# Altium schematic sheet con-left-top.SchDoc: Copper Suicide - Left Top
size Letter; CheckedBy: E. Chiu; CompanyName: Signal Laboratories, Inc.; DrawnBy: J. Brinton; Engineer: J. Brinton; Address1: 3479 Edison Way; Address2: Menlo Park CA 94025; Address3: +1 (877) 778-8435; Address4: siglabs.com; Revision: 1; SheetNumber: 30; SheetTotal: 44
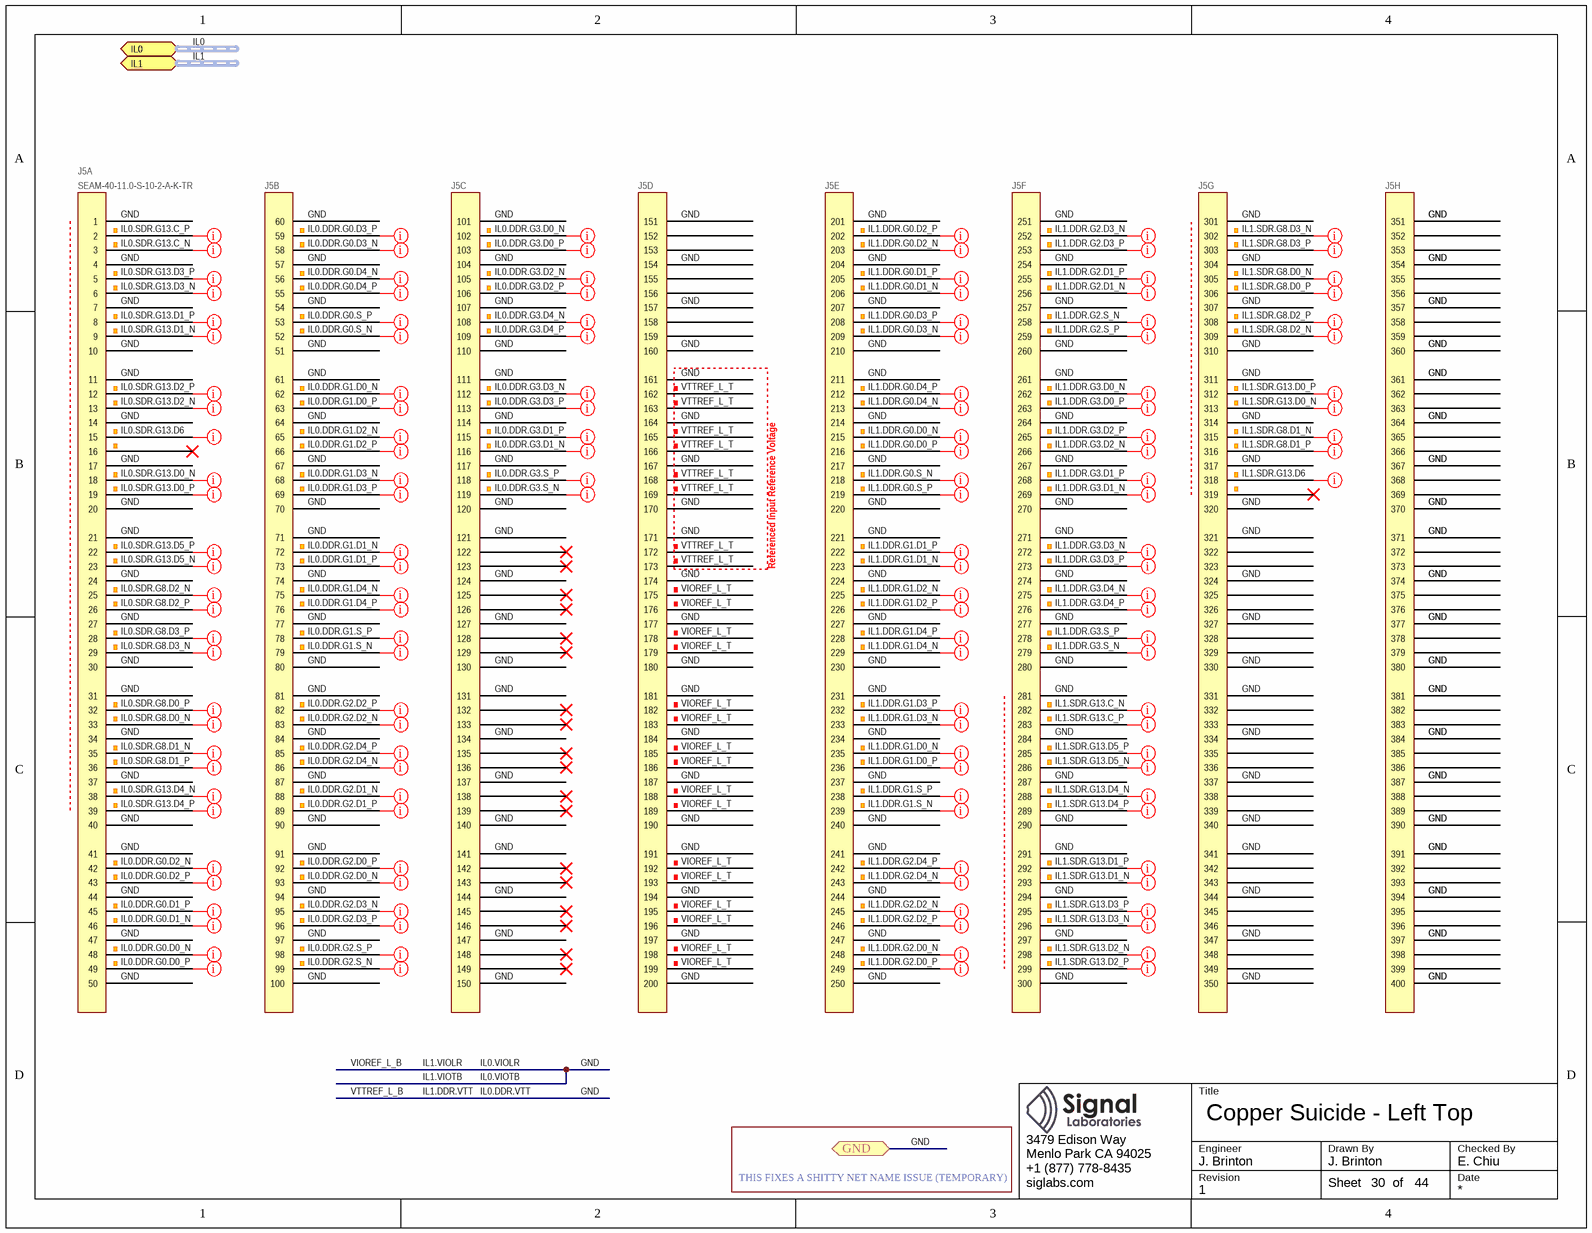
[diagram p0: con-left-top.SchDoc]

## Parts
J5  SEAM-40-11.0-S-10-2-A-K-TR  [SEAM-40-11.0-S-10-2-A-K-TR]  (parts A,B,C,D,E,F,G,H of 8)

## Ports
GND, IL0 (harness IL), IL1 (harness IL)

## Nets
GND: J5.1 J5.4 J5.7 J5.10 J5.11 J5.14 J5.17 J5.20 J5.21 J5.24 J5.27 J5.30 J5.31 J5.34 J5.37 J5.40 J5.41 J5.44 J5.47 J5.50 J5.51 J5.54 J5.57 J5.60 J5.61 J5.64 J5.67 J5.70 J5.71 J5.74 J5.77 J5.80 J5.81 J5.84 J5.87 J5.90 J5.91 J5.94 J5.97 J5.100 J5.101 J5.104 J5.107 J5.110 J5.111 J5.114 J5.117 J5.120 J5.121 J5.124 J5.127 J5.130 J5.131 J5.134 J5.137 J5.140 J5.141 J5.144 J5.147 J5.150 J5.151 J5.154 J5.157 J5.160 J5.161 J5.164 J5.167 J5.170 J5.171 J5.174 J5.177 J5.180 J5.181 J5.184 J5.187 J5.190 J5.191 J5.194 J5.197 J5.200 J5.201 J5.204 J5.207 J5.210 J5.211 J5.214 J5.217 J5.220 J5.221 J5.224 J5.227 J5.230 J5.231 J5.234 J5.237 J5.240 J5.241 J5.244 J5.247 J5.250 J5.251 J5.254 J5.257 J5.260 J5.261 J5.264 J5.267 J5.270 J5.271 J5.274 J5.277 J5.280 J5.281 J5.284 J5.287 J5.290 J5.291 J5.294 J5.297 J5.300 J5.301 J5.304 J5.307 J5.310 J5.311 J5.314 J5.317 J5.320 J5.321 J5.324 J5.327 J5.330 J5.331 J5.334 J5.337 J5.340 J5.341 J5.344 J5.347 J5.350 J5.351 J5.354 J5.357 J5.360 J5.361 J5.364 J5.367 J5.370 J5.371 J5.374 J5.377 J5.380 J5.381 J5.384 J5.387 J5.390 J5.391 J5.394 J5.397 J5.400 ; port GND  [also labelled IL0.DDR.VTT, IL0.VIOLR, IL0.VIOTB, IL1.DDR.VTT, IL1.VIOLR, IL1.VIOTB, VIOREF_L_B, VTTREF_L_B]
IL0.DDR.G0.D0_N: J5.48
IL0.DDR.G0.D0_P: J5.49
IL0.DDR.G0.D1_N: J5.46
IL0.DDR.G0.D1_P: J5.45
IL0.DDR.G0.D2_N: J5.42
IL0.DDR.G0.D2_P: J5.43
IL0.DDR.G0.D3_N: J5.58
IL0.DDR.G0.D3_P: J5.59
IL0.DDR.G0.D4_N: J5.56
IL0.DDR.G0.D4_P: J5.55
IL0.DDR.G0.S_N: J5.52
IL0.DDR.G0.S_P: J5.53
IL0.DDR.G1.D0_N: J5.62
IL0.DDR.G1.D0_P: J5.63
IL0.DDR.G1.D1_N: J5.72
IL0.DDR.G1.D1_P: J5.73
IL0.DDR.G1.D2_N: J5.65
IL0.DDR.G1.D2_P: J5.66
IL0.DDR.G1.D3_N: J5.68
IL0.DDR.G1.D3_P: J5.69
IL0.DDR.G1.D4_N: J5.75
IL0.DDR.G1.D4_P: J5.76
IL0.DDR.G1.S_N: J5.79
IL0.DDR.G1.S_P: J5.78
IL0.DDR.G2.D0_N: J5.93
IL0.DDR.G2.D0_P: J5.92
IL0.DDR.G2.D1_N: J5.88
IL0.DDR.G2.D1_P: J5.89
IL0.DDR.G2.D2_N: J5.83
IL0.DDR.G2.D2_P: J5.82
IL0.DDR.G2.D3_N: J5.95
IL0.DDR.G2.D3_P: J5.96
IL0.DDR.G2.D4_N: J5.86
IL0.DDR.G2.D4_P: J5.85
IL0.DDR.G2.S_N: J5.99
IL0.DDR.G2.S_P: J5.98
IL0.DDR.G3.D0_N: J5.102
IL0.DDR.G3.D0_P: J5.103
IL0.DDR.G3.D1_N: J5.116
IL0.DDR.G3.D1_P: J5.115
IL0.DDR.G3.D2_N: J5.105
IL0.DDR.G3.D2_P: J5.106
IL0.DDR.G3.D3_N: J5.112
IL0.DDR.G3.D3_P: J5.113
IL0.DDR.G3.D4_N: J5.108
IL0.DDR.G3.D4_P: J5.109
IL0.DDR.G3.S_N: J5.119
IL0.DDR.G3.S_P: J5.118
IL0.SDR.G8.D0_N: J5.33
IL0.SDR.G8.D0_P: J5.32
IL0.SDR.G8.D1_N: J5.35
IL0.SDR.G8.D1_P: J5.36
IL0.SDR.G8.D2_N: J5.25
IL0.SDR.G8.D2_P: J5.26
IL0.SDR.G8.D3_N: J5.29
IL0.SDR.G8.D3_P: J5.28
IL0.SDR.G13.C_N: J5.3
IL0.SDR.G13.C_P: J5.2
IL0.SDR.G13.D0_N: J5.18
IL0.SDR.G13.D0_P: J5.19
IL0.SDR.G13.D1_N: J5.9
IL0.SDR.G13.D1_P: J5.8
IL0.SDR.G13.D2_N: J5.13
IL0.SDR.G13.D2_P: J5.12
IL0.SDR.G13.D3_N: J5.6
IL0.SDR.G13.D3_P: J5.5
IL0.SDR.G13.D4_N: J5.38
IL0.SDR.G13.D4_P: J5.39
IL0.SDR.G13.D5_N: J5.23
IL0.SDR.G13.D5_P: J5.22
IL0.SDR.G13.D6: J5.15
IL1.DDR.G0.D0_N: J5.215
IL1.DDR.G0.D0_P: J5.216
IL1.DDR.G0.D1_N: J5.206
IL1.DDR.G0.D1_P: J5.205
IL1.DDR.G0.D2_N: J5.203
IL1.DDR.G0.D2_P: J5.202
IL1.DDR.G0.D3_N: J5.209
IL1.DDR.G0.D3_P: J5.208
IL1.DDR.G0.D4_N: J5.213
IL1.DDR.G0.D4_P: J5.212
IL1.DDR.G0.S_N: J5.218
IL1.DDR.G0.S_P: J5.219
IL1.DDR.G1.D0_N: J5.235
IL1.DDR.G1.D0_P: J5.236
IL1.DDR.G1.D1_N: J5.223
IL1.DDR.G1.D1_P: J5.222
IL1.DDR.G1.D2_N: J5.225
IL1.DDR.G1.D2_P: J5.226
IL1.DDR.G1.D3_N: J5.233
IL1.DDR.G1.D3_P: J5.232
IL1.DDR.G1.D4_N: J5.229
IL1.DDR.G1.D4_P: J5.228
IL1.DDR.G1.S_N: J5.239
IL1.DDR.G1.S_P: J5.238
IL1.DDR.G2.D0_N: J5.248
IL1.DDR.G2.D0_P: J5.249
IL1.DDR.G2.D1_N: J5.256
IL1.DDR.G2.D1_P: J5.255
IL1.DDR.G2.D2_N: J5.245
IL1.DDR.G2.D2_P: J5.246
IL1.DDR.G2.D3_N: J5.252
IL1.DDR.G2.D3_P: J5.253
IL1.DDR.G2.D4_N: J5.243
IL1.DDR.G2.D4_P: J5.242
IL1.DDR.G2.S_N: J5.258
IL1.DDR.G2.S_P: J5.259
IL1.DDR.G3.D0_N: J5.262
IL1.DDR.G3.D0_P: J5.263
IL1.DDR.G3.D1_N: J5.269
IL1.DDR.G3.D1_P: J5.268
IL1.DDR.G3.D2_N: J5.266
IL1.DDR.G3.D2_P: J5.265
IL1.DDR.G3.D3_N: J5.272
IL1.DDR.G3.D3_P: J5.273
IL1.DDR.G3.D4_N: J5.275
IL1.DDR.G3.D4_P: J5.276
IL1.DDR.G3.S_N: J5.279
IL1.DDR.G3.S_P: J5.278
IL1.SDR.G8.D0_N: J5.305
IL1.SDR.G8.D0_P: J5.306
IL1.SDR.G8.D1_N: J5.315
IL1.SDR.G8.D1_P: J5.316
IL1.SDR.G8.D2_N: J5.309
IL1.SDR.G8.D2_P: J5.308
IL1.SDR.G8.D3_N: J5.302
IL1.SDR.G8.D3_P: J5.303
IL1.SDR.G13.C_N: J5.282
IL1.SDR.G13.C_P: J5.283
IL1.SDR.G13.D0_N: J5.313
IL1.SDR.G13.D0_P: J5.312
IL1.SDR.G13.D1_N: J5.293
IL1.SDR.G13.D1_P: J5.292
IL1.SDR.G13.D2_N: J5.298
IL1.SDR.G13.D2_P: J5.299
IL1.SDR.G13.D3_N: J5.296
IL1.SDR.G13.D3_P: J5.295
IL1.SDR.G13.D4_N: J5.288
IL1.SDR.G13.D4_P: J5.289
IL1.SDR.G13.D5_N: J5.286
IL1.SDR.G13.D5_P: J5.285
IL1.SDR.G13.D6: J5.318
VIOREF_L_T: J5.175 J5.176 J5.178 J5.179 J5.182 J5.183 J5.185 J5.186 J5.188 J5.189 J5.192 J5.193 J5.195 J5.196 J5.198 J5.199
VTTREF_L_T: J5.162 J5.163 J5.165 J5.166 J5.168 J5.169 J5.172 J5.173

Not connected (* = marked no-connect by the designer): J5 16* 122* 123* 125* 126* 128* 129* 132* 133* 135* 136* 138* 139* 142* 143* 145* 146* 148* 149* 152 153 155 156 158 159 319* 322 323 325 326 328 329 332 333 335 336 338 339 342 343 345 346 348 349 352 353 355 356 358 359 362 363 365 366 368 369 372 373 375 376 378 379 382 383 385 386 388 389 392 393 395 396 398 399

## Buses and harness runs
harness IL0 = port IL0
harness IL1 = port IL1

## Layout directives
net class z50; differential pair; net class loose: IL0.DDR.G0.D0_N, IL0.DDR.G0.D0_P, IL0.DDR.G0.D1_N, IL0.DDR.G0.D1_P, IL0.DDR.G0.D2_N, IL0.DDR.G0.D2_P, IL0.DDR.G0.D3_N, IL0.DDR.G0.D3_P, IL0.DDR.G0.D4_N, IL0.DDR.G0.D4_P, IL0.DDR.G0.S_N, IL0.DDR.G0.S_P, IL0.DDR.G1.D0_N, IL0.DDR.G1.D0_P, IL0.DDR.G1.D1_N, IL0.DDR.G1.D1_P, IL0.DDR.G1.D2_N, IL0.DDR.G1.D2_P, IL0.DDR.G1.D3_N, IL0.DDR.G1.D3_P, IL0.DDR.G1.D4_N, IL0.DDR.G1.D4_P, IL0.DDR.G1.S_N, IL0.DDR.G1.S_P, IL0.DDR.G2.D0_N, IL0.DDR.G2.D0_P, IL0.DDR.G2.D1_N, IL0.DDR.G2.D1_P, IL0.DDR.G2.D2_N, IL0.DDR.G2.D2_P, IL0.DDR.G2.D3_N, IL0.DDR.G2.D3_P, IL0.DDR.G2.D4_N, IL0.DDR.G2.D4_P, IL0.DDR.G2.S_N, IL0.DDR.G2.S_P, IL0.DDR.G3.D0_N, IL0.DDR.G3.D0_P, IL0.DDR.G3.D1_N, IL0.DDR.G3.D1_P, IL0.DDR.G3.D2_N, IL0.DDR.G3.D2_P, IL0.DDR.G3.D3_N, IL0.DDR.G3.D3_P, IL0.DDR.G3.D4_N, IL0.DDR.G3.D4_P, IL0.DDR.G3.S_N, IL0.DDR.G3.S_P, IL0.SDR.G8.D0_N, IL0.SDR.G8.D0_P, IL0.SDR.G8.D1_N, IL0.SDR.G8.D1_P, IL0.SDR.G8.D2_N, IL0.SDR.G8.D2_P, IL0.SDR.G8.D3_N, IL0.SDR.G8.D3_P, IL0.SDR.G13.C_N, IL0.SDR.G13.C_P, IL0.SDR.G13.D0_N, IL0.SDR.G13.D0_P, IL0.SDR.G13.D1_N, IL0.SDR.G13.D1_P, IL0.SDR.G13.D2_N, IL0.SDR.G13.D2_P, IL0.SDR.G13.D3_N, IL0.SDR.G13.D3_P, IL0.SDR.G13.D4_N, IL0.SDR.G13.D4_P, IL0.SDR.G13.D5_N, IL0.SDR.G13.D5_P, IL1.DDR.G0.D0_N, IL1.DDR.G0.D0_P, IL1.DDR.G0.D1_N, IL1.DDR.G0.D1_P, IL1.DDR.G0.D2_N, IL1.DDR.G0.D2_P, IL1.DDR.G0.D3_N, IL1.DDR.G0.D3_P, IL1.DDR.G0.D4_N, IL1.DDR.G0.D4_P, IL1.DDR.G0.S_N, IL1.DDR.G0.S_P, IL1.DDR.G1.D0_N, IL1.DDR.G1.D0_P, IL1.DDR.G1.D1_N, IL1.DDR.G1.D1_P, IL1.DDR.G1.D2_N, IL1.DDR.G1.D2_P, IL1.DDR.G1.D3_N, IL1.DDR.G1.D3_P, IL1.DDR.G1.D4_N, IL1.DDR.G1.D4_P, IL1.DDR.G1.S_N, IL1.DDR.G1.S_P, IL1.DDR.G2.D0_N, IL1.DDR.G2.D0_P, IL1.DDR.G2.D1_N, IL1.DDR.G2.D1_P, IL1.DDR.G2.D2_N, IL1.DDR.G2.D2_P, IL1.DDR.G2.D3_N, IL1.DDR.G2.D3_P, IL1.DDR.G2.D4_N, IL1.DDR.G2.D4_P, IL1.DDR.G2.S_N, IL1.DDR.G2.S_P, IL1.DDR.G3.D0_N, IL1.DDR.G3.D0_P, IL1.DDR.G3.D1_N, IL1.DDR.G3.D1_P, IL1.DDR.G3.D2_N, IL1.DDR.G3.D2_P, IL1.DDR.G3.D3_N, IL1.DDR.G3.D3_P, IL1.DDR.G3.D4_N, IL1.DDR.G3.D4_P, IL1.DDR.G3.S_N, IL1.DDR.G3.S_P, IL1.SDR.G8.D0_N, IL1.SDR.G8.D0_P, IL1.SDR.G8.D1_N, IL1.SDR.G8.D1_P, IL1.SDR.G8.D2_N, IL1.SDR.G8.D2_P, IL1.SDR.G8.D3_N, IL1.SDR.G8.D3_P, IL1.SDR.G13.C_N, IL1.SDR.G13.C_P, IL1.SDR.G13.D0_N, IL1.SDR.G13.D0_P, IL1.SDR.G13.D1_N, IL1.SDR.G13.D1_P, IL1.SDR.G13.D2_N, IL1.SDR.G13.D2_P, IL1.SDR.G13.D3_N, IL1.SDR.G13.D3_P, IL1.SDR.G13.D4_N, IL1.SDR.G13.D4_P, IL1.SDR.G13.D5_N, IL1.SDR.G13.D5_P
net class z50: IL0.SDR.G13.D6, IL1.SDR.G13.D6

## Notes on the sheet
- Referenced Input Reference Voltage
- THIS FIXES A SHITTY NET NAME ISSUE (TEMPORARY)
- Title
- Engineer
- Revision
- Drawn By
- Checked By
- Date
- Sheet
- of

## Library data of the parts
J5 = SEAM-40-11.0-S-10-2-A-K-TR: Terminal Array Assembly, Surface Mount, 0.050" Pitch, 400 Pins; Manufacturer: Samtec; Manufacturer P/N: SEAM-40-11.0-S-10-2-A-K-TR